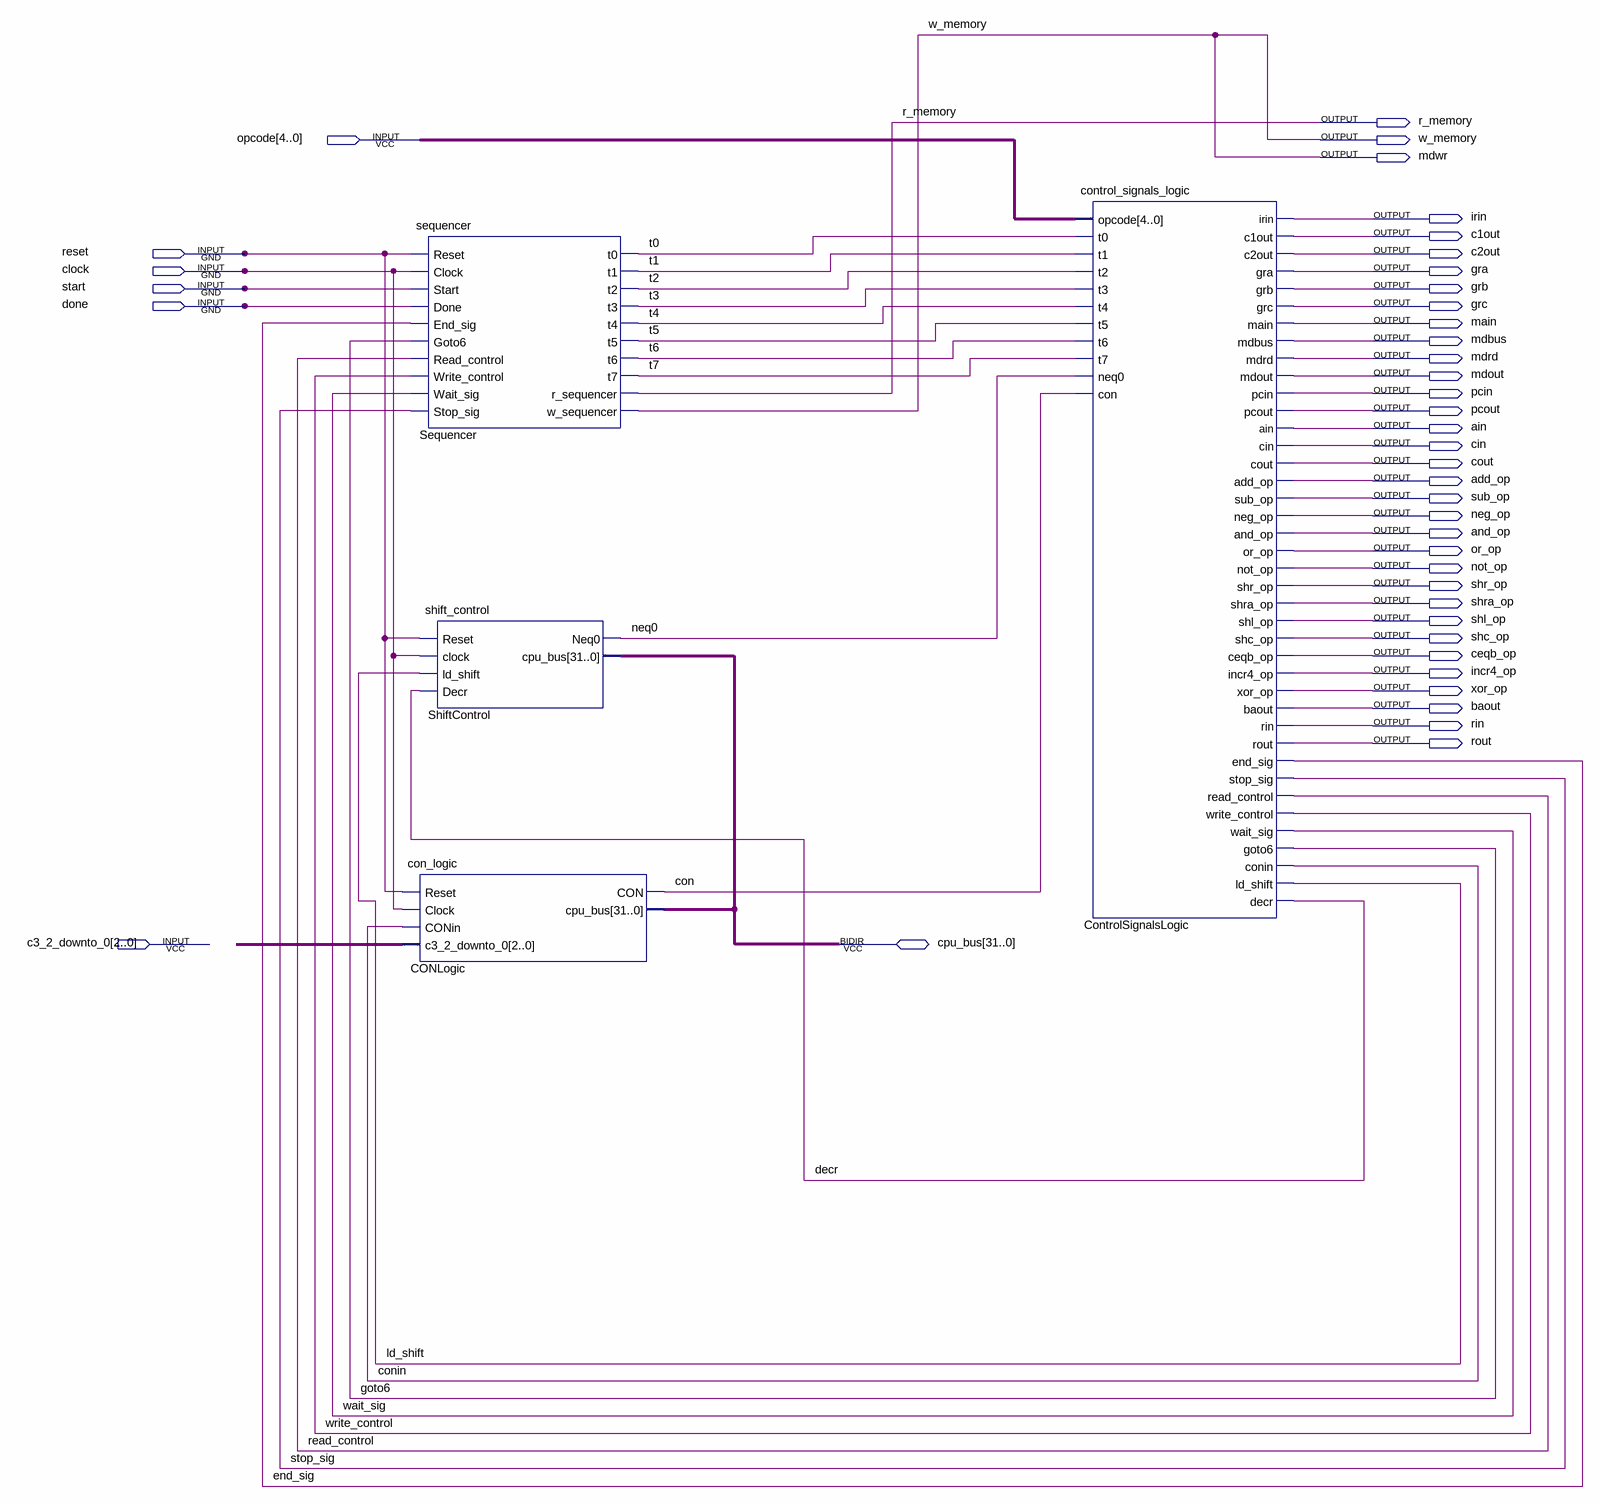
[diagram p0: schematic sheet]
// Quartus schematic ControlUnit.bdf as structural Verilog: 4 symbols, 41 pins
module ControlUnit (
  input  [4:0] opcode,
  input  reset,
  input  clock,
  input  start,
  input  done,
  input  [2:0] c3_2_downto_0,
  inout  [31:0] cpu_bus,
  output r_memory,
  output w_memory,
  output mdwr,
  output irin,
  output c1out,
  output c2out,
  output gra,
  output grb,
  output grc,
  output main,
  output mdbus,
  output mdrd,
  output mdout,
  output pcin,
  output pcout,
  output ain,
  output cin,
  output cout,
  output add_op,
  output sub_op,
  output neg_op,
  output and_op,
  output or_op,
  output not_op,
  output shr_op,
  output shra_op,
  output shl_op,
  output shc_op,
  output ceqb_op,
  output incr4_op,
  output xor_op,
  output baout,
  output rin,
  output rout
);

  wire con, conin, decr, end_sig, goto6, ld_shift, neq0, read_control, stop_sig, t0, t1, t2, t3, t4, t5, t6,
       t7, wait_sig, write_control;
  wire [2:0] undriven;

  sequencer Sequencer (
    .Reset(reset), .Clock(clock), .Start(start), .Done(done), .End_sig(end_sig), .Goto6(goto6),
    .Read_control(read_control), .Write_control(write_control), .Wait_sig(wait_sig), .Stop_sig(stop_sig),
    .t0(t0), .t1(t1), .t2(t2), .t3(t3), .t4(t4), .t5(t5), .t6(t6), .t7(t7), .r_sequencer(r_memory),
    .w_sequencer(mdwr));
  shift_control ShiftControl (
    .Reset(reset), .clock(clock), .ld_shift(ld_shift), .Decr(decr), .Neq0(neq0), .cpu_bus(cpu_bus));
  con_logic CONLogic (
    .Reset(reset), .Clock(clock), .CONin(conin), .c3_2_downto_0(undriven), .CON(con), .cpu_bus(cpu_bus));
  control_signals_logic ControlSignalsLogic (
    .opcode(opcode), .t0(t0), .t1(t1), .t2(t2), .t3(t3), .t4(t4), .t5(t5), .t6(t6), .t7(t7), .neq0(neq0),
    .con(con), .irin(irin), .c1out(c1out), .c2out(c2out), .gra(gra), .grb(grb), .grc(grc), .main(main),
    .mdbus(mdbus), .mdrd(mdrd), .mdout(mdout), .pcin(pcin), .pcout(pcout), .ain(ain), .cin(cin), .cout(cout),
    .add_op(add_op), .sub_op(sub_op), .neg_op(neg_op), .and_op(and_op), .or_op(or_op), .not_op(not_op),
    .shr_op(shr_op), .shra_op(shra_op), .shl_op(shl_op), .shc_op(shc_op), .ceqb_op(ceqb_op),
    .incr4_op(incr4_op), .xor_op(xor_op), .baout(baout), .rin(rin), .rout(rout), .end_sig(end_sig),
    .stop_sig(stop_sig), .read_control(read_control), .write_control(write_control), .wait_sig(wait_sig),
    .goto6(goto6), .conin(conin), .ld_shift(ld_shift), .decr(decr));

  assign w_memory = mdwr;
endmodule
